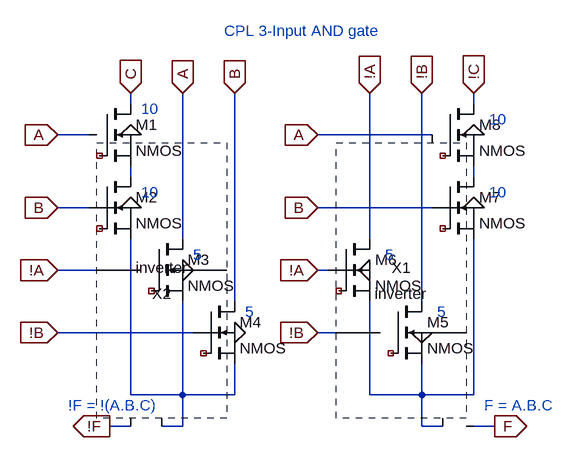
[diagram p0: schematic cpl_and3.asc]
cpl_and3.asc, the LTspice schematic file:
Version 4
SHEET 1 1292 680
WIRE -1408 -320 -1408 -336
WIRE -880 -320 -880 -336
WIRE -1472 -272 -1520 -272
WIRE -944 -272 -1120 -272
WIRE -1408 -208 -1408 -224
WIRE -880 -208 -880 -224
WIRE -1472 -160 -1520 -160
WIRE -944 -160 -1120 -160
WIRE -1328 -112 -1328 -336
WIRE -1040 -112 -1040 -336
WIRE -1392 -64 -1520 -64
WIRE -1104 -64 -1120 -64
WIRE -1248 -16 -1248 -336
WIRE -960 -16 -960 -336
WIRE -1312 32 -1520 32
WIRE -1024 32 -1120 32
WIRE -1408 128 -1408 -112
WIRE -1328 128 -1328 -16
WIRE -1328 128 -1408 128
WIRE -1248 128 -1248 80
WIRE -1248 128 -1328 128
WIRE -1040 128 -1040 -16
WIRE -960 128 -960 80
WIRE -960 128 -1040 128
WIRE -880 128 -880 -112
WIRE -880 128 -960 128
WIRE -1408 176 -1440 176
WIRE -1328 176 -1328 128
WIRE -1328 176 -1360 176
WIRE -960 176 -960 128
WIRE -928 176 -960 176
WIRE -848 176 -880 176
FLAG -1408 -336 C
IOPIN -1408 -336 In
FLAG -1520 -272 A
IOPIN -1520 -272 In
FLAG -1520 -64 !A
IOPIN -1520 -64 In
FLAG -1520 -160 B
IOPIN -1520 -160 In
FLAG -1520 32 !B
IOPIN -1520 32 In
FLAG -1328 -336 A
IOPIN -1328 -336 In
FLAG -1248 -336 B
IOPIN -1248 -336 In
FLAG -1408 -272 0
FLAG -1408 -160 0
FLAG -1328 -64 0
FLAG -1248 32 0
FLAG -1040 -336 !A
IOPIN -1040 -336 In
FLAG -960 -336 !B
IOPIN -960 -336 In
FLAG -1040 -64 0
FLAG -960 32 0
FLAG -880 -336 !C
IOPIN -880 -336 In
FLAG -880 -272 0
FLAG -880 -160 0
FLAG -1120 -272 A
IOPIN -1120 -272 In
FLAG -1120 -64 !A
IOPIN -1120 -64 In
FLAG -1120 -160 B
IOPIN -1120 -160 In
FLAG -1120 32 !B
IOPIN -1120 32 In
FLAG -848 176 F
IOPIN -848 176 Out
FLAG -1440 176 !F
IOPIN -1440 176 Out
SYMBOL nmos -1376 -112 R0
SYMATTR InstName M3
SYMATTR Value2 l=0.6u w=1.5u
SYMBOL nmos -1296 -16 R0
SYMATTR InstName M4
SYMATTR Value2 l=0.6u w=1.5u
SYMBOL nmos -1008 -16 R0
SYMATTR InstName M5
SYMATTR Value2 l=0.6u w=1.5u
SYMBOL nmos -1088 -112 R0
SYMATTR InstName M6
SYMATTR Value2 l=0.6u w=1.5u
SYMBOL inverter -1376 176 R180
SYMATTR InstName X2
SYMBOL inverter -912 176 R0
SYMATTR InstName X1
SYMBOL nmos -1456 -320 R0
SYMATTR InstName M1
SYMATTR Value2 l=0.6u w=3u
SYMATTR SpiceModel ""
SYMATTR Value NMOS
SYMBOL nmos -1456 -208 R0
SYMATTR InstName M2
SYMATTR Value2 l=0.6u w=3u
SYMATTR SpiceModel ""
SYMATTR Value NMOS
SYMBOL nmos -928 -208 R0
SYMATTR InstName M7
SYMATTR Value2 l=0.6u w=3u
SYMATTR SpiceModel ""
SYMATTR Value NMOS
SYMBOL nmos -928 -320 R0
SYMATTR InstName M8
SYMATTR Value2 l=0.6u w=3u
SYMATTR SpiceModel ""
SYMATTR Value NMOS
TEXT -1264 -432 Left 2 ;CPL 3-Input AND gate
TEXT -864 144 Left 2 ;F = A.B.C
TEXT -1504 144 Left 2 ;!F = !(A.B.C)
TEXT -1392 -184 Left 2 ;10
TEXT -1312 -88 Left 2 ;5
TEXT -1232 0 Left 2 ;5
TEXT -856 -296 Left 2 ;10
TEXT -856 -184 Left 2 ;10
TEXT -1016 -88 Left 2 ;5
TEXT -936 0 Left 2 ;5
TEXT -1392 -312 Left 2 ;10

The netlist it stands for:
* cpl_and3.asc
M3 A NC_01 N003 N003 NMOS l=0.6u w=1.5u
M4 B NC_02 N003 N003 NMOS l=0.6u w=1.5u
M5 !B NC_03 N004 N004 NMOS l=0.6u w=1.5u
M6 !A NC_04 N004 N004 NMOS l=0.6u w=1.5u
* X2: inverter (symbol inverter not available, pin order unknown); nets seen at it: !A, !B, !F, 0, A, B, N003
* X1: inverter (symbol inverter not available, pin order unknown); nets seen at it: !A, !B, 0, A, B, F, N004
M1 C NC_05 N001 N001 NMOS l=0.6u w=3u
M2 N001 NC_06 N003 N003 NMOS l=0.6u w=3u
M7 N002 NC_07 N004 N004 NMOS l=0.6u w=3u
M8 !C NC_08 N002 N002 NMOS l=0.6u w=3u
.model NMOS NMOS
.model PMOS PMOS
.lib standard.mos
* CPL 3-Input AND gate
* F = A.B.C
* !F = !(A.B.C)
* 10
* 5
* 5
* 10
* 10
* 5
* 5
* 10
.backanno
.end